# EAGLE design Button (EAGLE 5.04)
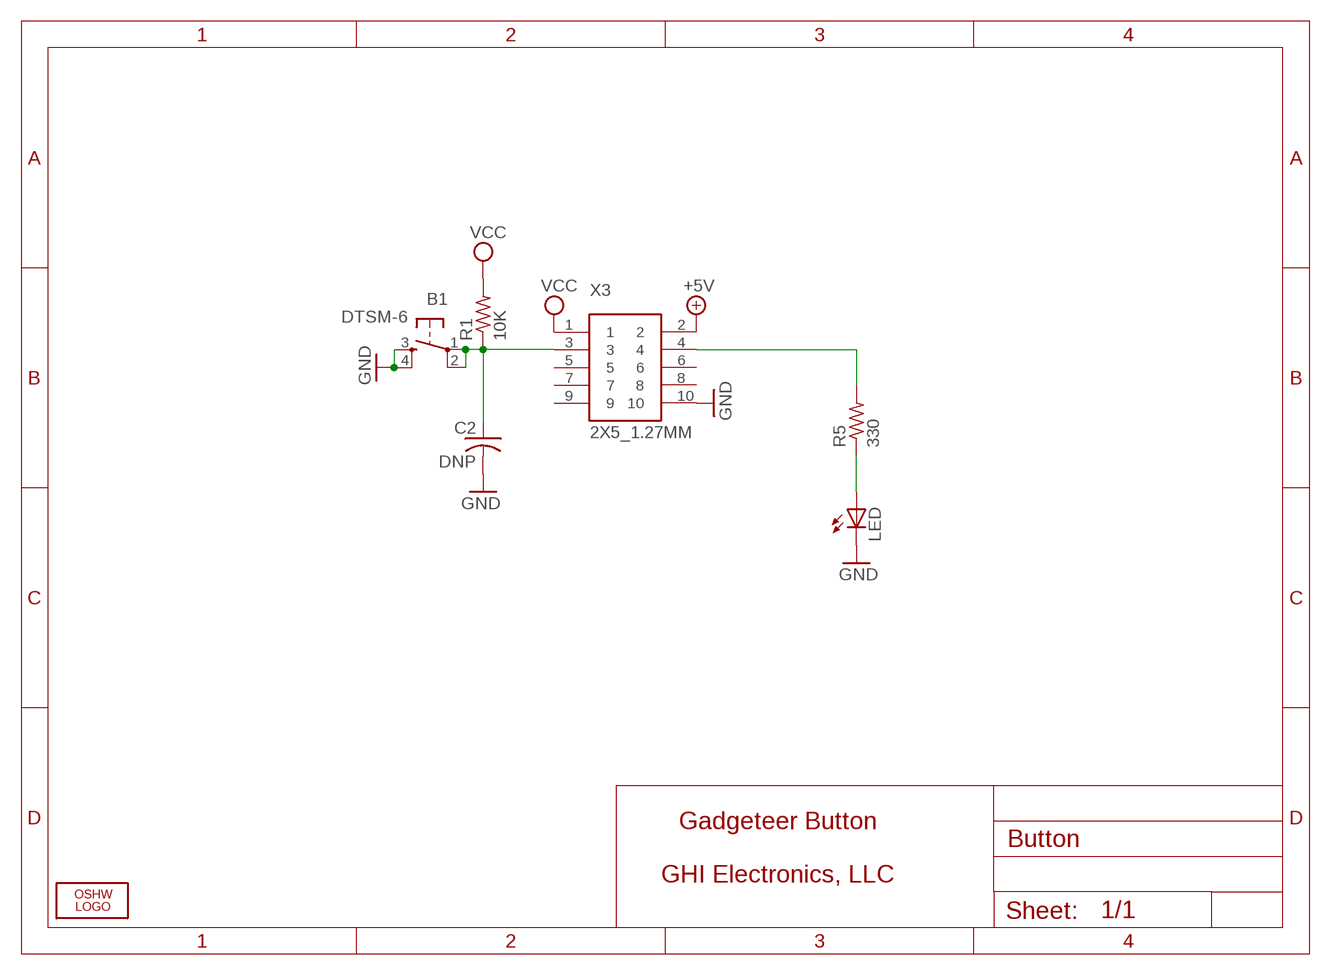
[diagram p0: schematic, sheet 1]

## Parts
B1  DTSM-6  [DTSM-6]
C2  DNP  C-USC0603K  [C0603K]
LED  LEDCHIPLED_0805  [CHIPLED_0805]
LOGO1  LOGO-OSHW-FILLX0200-NT  [OSHW_FILLX200_NOTEXT]
R1  10K  R-US_R0603  [R0603]
R5  330  R-US_R0603  [R0603]
X3  2X5_1.27MM  [2X5_1.27MM]

## Nets
+5V [power]: X3.2
GND [power]: B1.3 B1.4 C2.2 LED.C X3.10
N$1: LED.A R5.1
N$2: B1.1 B1.2 C2.1 R1.1 X3.3
N$3: R5.2 X3.4
VCC [power]: R1.2 X3.1
Unconnected: X3.5 X3.6 X3.7 X3.8 X3.9

## Notes on the sheet
- Gadgeteer Button
- GHI Electronics, LLC

## Library data of the parts
B1 = switch-tact:DTSM-6
C2 = rcl:C-US: CAPACITOR, American symbol
LED = led:LED: LED OSRAM: - CHIPLED LG R971, LG N971, LY N971, LG Q971, LY Q971, LO R971, LY R971 LH N974, LH R974 LS Q976, LO Q976, LY Q976 LO Q996 - Hyper CHIPLED LW Q18S LB Q993, LB Q99A, LB R99A - SideLED LS A670, LO A670, LY A670, LG A670, LP A670 LB A673, LV A673, LT A673, LW A673 LH A674 LY A675 LS A676, LA A676, LO A676, LY A676, LW A676 LS A679, LY A679, LG A679 - Hyper Micro SIDELED® LS Y876, LA Y876, LO Y876, LY Y876 LT Y87S - SmartLED LW L88C, LW L88S LB L89C, LB L89S, LG L890 LS L89K, LO L89K, LY L89K LS L896, LA L896, LO L896, LY L896 - TOPLED LS T670, LO T670, LY T670, LG T670, LP T670 LSG T670, LSP T670, LSY T670, LOP T670, LYG T670 LG T671, LOG T671, LSG T671 LB T673, LV T673, LT T673, LW T673 LH T674 LS T676, LA T676, LO T676, LY T676, LB T676, LH T676, LSB T676, LW T676 LB T67C, LV T67C, LT T67C, LS T67K, LO T67K, LY T67K, LW E67C LS E67B, LA E67B, LO E67B, LY E67B, LB E67C, LV E67C, LT E67C LW T67C LS T679, LY T679, LG T679 LS T770, LO T770, LY T770, LG T770, LP T770 LB T773, LV T773, LT T773, LW T773 LH T774 LS E675, LA E675, LY E675, LS T675 LS T776, LA T776, LO T776, LY T776, LB T776 LHGB T686 LT T68C, LB T68C - Hyper Mini TOPLED® LB M676 - Mini TOPLED Santana® LG M470 LS M47K, LO M47K, LY M47K Source: http://www.osram.convergy.de LUXEON: - LUMILED® LXK2-PW12-R00, LXK2-PW12-S00, LXK2-PW14-U00, LXK2-PW14-V00 LXK2-PM12-R00, LXK2-PM12-S00, LXK2-PM14-U00 LXK2-PE12-Q00, LXK2-PE12-R00, LXK2-PE12-S00, LXK2-PE14-T00, LXK2-PE14-U00 LXK2-PB12-K00, LXK2-PB12-L00, LXK2-PB12-M00, LXK2-PB14-N00, LXK2-PB14-P00, LXK2-PB14-Q00 LXK2-PR12-L00, LXK2-PR12-M00, LXK2-PR14-Q00, LXK2-PR14-R00 LXK2-PD12-Q00, LXK2-PD12-R00, LXK2-PD12-S00 LXK2-PH12-R00, LXK2-PH12-S00 LXK2-PL12-P00, LXK2-PL12-Q00, LXK2-PL12-R00 Source: www.luxeon.com KINGBRIGHT: KA-3528ASYC Source: www.kingbright.com
LOGO1 = Logo:LOGO-OSHW-FILL
R1 R5 = rcl:R-US_: RESISTOR, American symbol
X3 = GHI:2X5_1.27MM

## Net classes
0 default: width 0.254 mm, drill 0.381 mm, clearance 0.203 mm

## Board
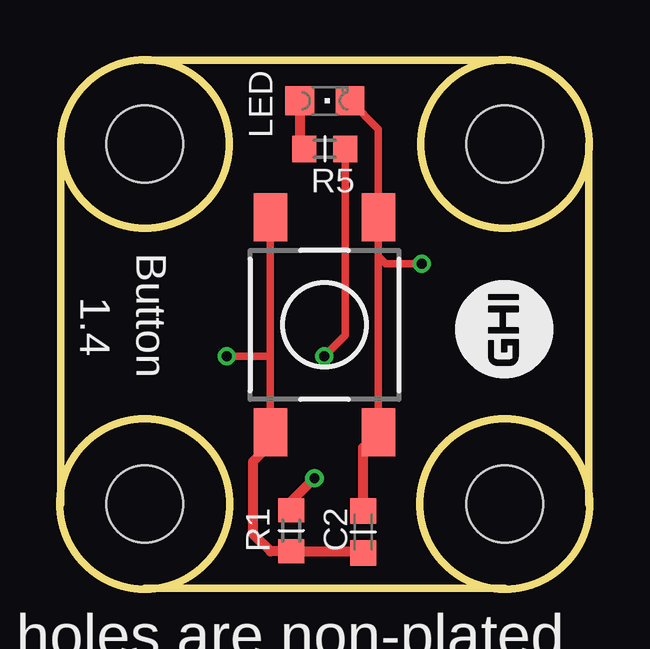
[diagram p1: board, top side]
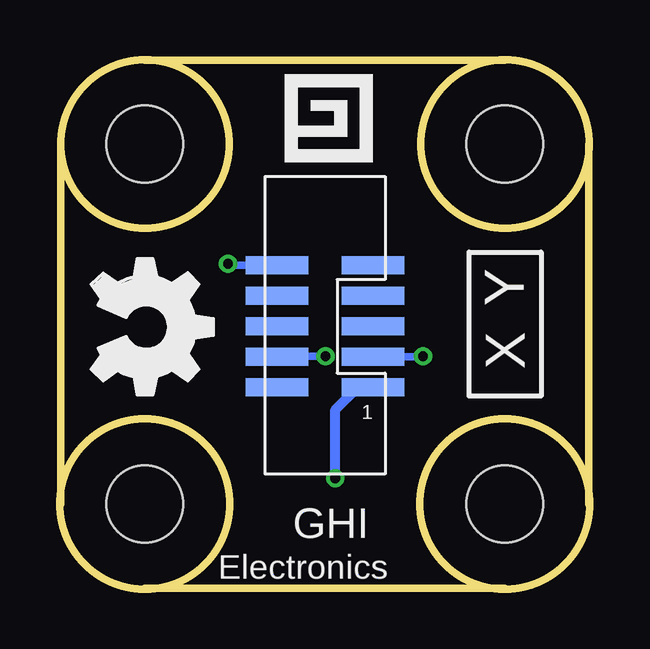
[diagram p2: board, bottom side, seen from below]

Size 22.07 x 22.04 mm. Coordinates in mm from the lower left corner, seen from the top.
Outline: 22.04,3.54 22.04,18.54
Outline: 0.04,18.54 0.04,3.54
Outline: 3.54,22.04 18.54,22.04
Outline: 18.54,0.04 3.54,0.04
Outline: circle at 3.54,18.54 radius 3.5
Outline: circle at 18.54,18.54 radius 3.5
Outline: circle at 18.54,3.54 radius 3.54
Outline: circle at 3.54,3.54 radius 3.54
Copper layers (1+16): Top 0.035mm / dielectric 1.5mm / Bottom 0.035mm
Design rules "default *": minimum track width 8mil, minimum drill 12mil, track to track 8mil, track to pad 8mil, pad to pad 8mil, via to via 8mil, smd to smd 8mil, copper to edge 15mil, drill to drill 8mil, minimum pad ring 10mil, minimum via ring 7mil, stop-mask expansion 4mil, vias tented up to drill 50mil, thermal gap 10mil
Holes 3.2 mm at 3.54,3.54 18.54,18.54 3.54,18.54 18.54,3.54

### Footprints (pad centres in the part's own frame; a part is rotated, then mirrored left to right if it is on the bottom)
DTSM-6 = smd 2 x 1.4: 1 -4.475,2.25; 2 4.475,2.25; 3 -4.475,-2.25; 4 4.475,-2.25
C0603K = smd 1.05 x 1.08: 1 -0.875,0; 2 0.875,0
CHIPLED_0805 = smd 1.2 x 1.2: A 0,-1.05; C 0,1.05
R0603 = smd 1 x 1.1: 1 -0.85,0; 2 0.85,0
2X5_1.27MM = smd 2.6 x 0.74: 1 -2,2.58; 2 2,2.58; 3 -2,1.31; 4 2,1.31; 5 -2,0.04; 6 2,0.04; 7 -2,-1.23; 8 2,-1.23; 9 -2,-2.5; 10 2,-2.5

### Placement (x,y rotation side)
B1  11.02,11 90 top
C2  12.63,2.37 90 top
LED  11.04,20.34 270 top
LOGO1  20.76,13.75 270 bottom
R1  9.64,2.42 90 top
R5  11.04,18.34 0 top
X3  11.03,10.99 180 bottom

### Tracks (layer width: path | path; a pad name or v marks a point on that pad's centre or on a via)
GND  (via drill 0.41)
  Top 0.305: B1.3 13.27,13.85 | 13.27,13.85 B1.4 13.27,19.15 LED.C | v15.07,13.55 13.57,13.55 13.27,13.85
  Top 0.406: C2.2 12.63,5.89 B1.3
  Bottom 0.305: X3.10 15.01,13.49 v15.07,13.55
N$1
  Top 0.406: LED.A 9.99,18.54 R5.1
N$2  (via drill 0.41)
  Top 0.305: B1.1 8.77,9.69 | 8.77,9.69 B1.2 | 8.77,9.69 v6.94,9.69
  Top 0.406: B1.1 8.77,6.03 8.06,5.32 8.06,2.27 8.77,1.56 9.62,1.56 R1.1 12.56,1.57 C2.1
  Bottom 0.305: X3.3 6.96,9.68 v6.94,9.69
N$3  (via drill 0.41)
  Top 0.305: R5.2 11.89,10.56 v11.01,9.69
  Bottom 0.305: v11.01,9.69 13.02,9.69 X3.4
VCC  (via drill 0.41)
  Top 0.406: R1.2 9.64,3.64 v10.6,4.61
  Bottom 0.406: X3.1 9.65,8.41 10.6,7.45 v10.6,4.61

### Text on the board
tPlace: Button | 1.4 | corner holes are non-plated | Black PCB with white print | Do not add any manufacturing Code!
bPlace: Y | X | GHI | Electronics
201bmp: C:/Users/Gus Issa/Desktop/GHILogo_BW.bmp